# Altium schematic sheet STM32G0B1CBT6TR.SchDoc
size 594 x 420 mm; SheetNumber: 2; SheetTotal: 4
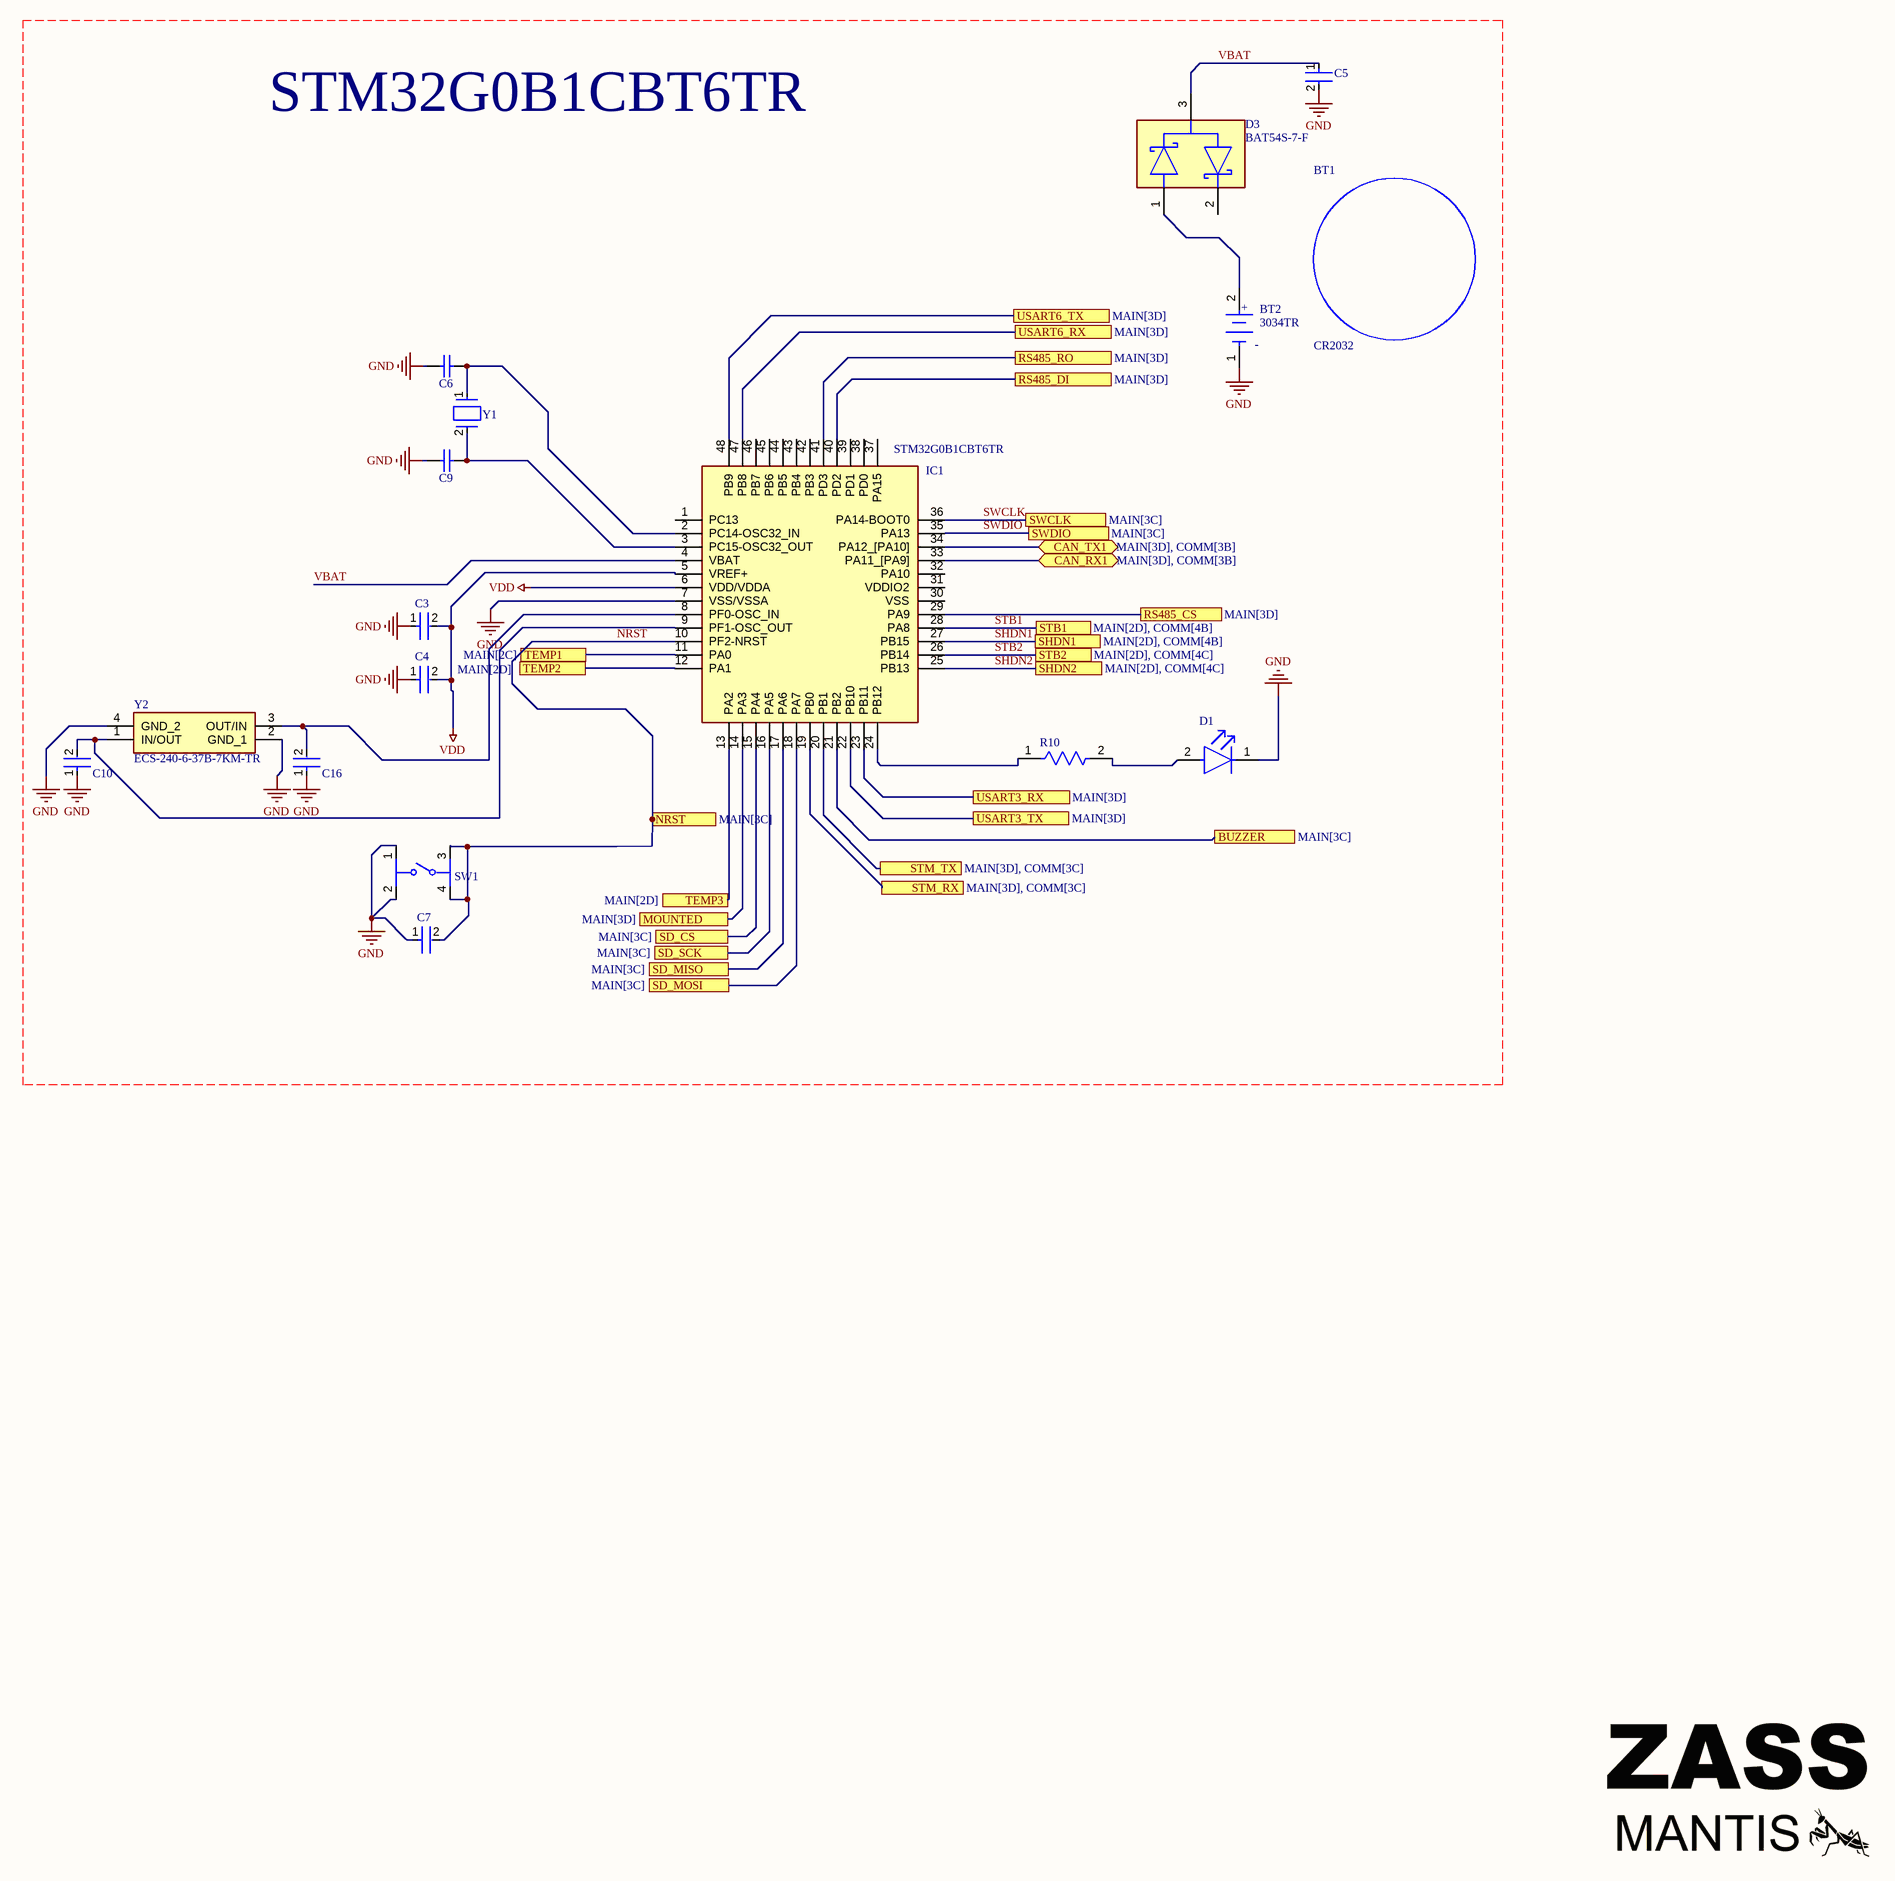
[diagram p0: STM32G0B1CBT6TR.SchDoc]

## Parts
BT1  CR2032  [FP-CR2032-MFG]
BT2  3034TR  [FP-3034TR-MFG]
C3  C0805C104K5RACTU  [FP-C0805C-DN-MFG]  (value not drawn)
C4  C0805C104K5RACTU  [FP-C0805C-DN-MFG]  (value not drawn)
C5  CC0805KRX7R5BB104  [FP-CC0805-EA-MFG]  (value not drawn)
C6  06035A220KAT2A  [CAPC1608X90X35ML15T15]  (value not drawn)
C7  C0805C104K5RACTU  [FP-C0805C-DN-MFG]  (value not drawn)
C9  06035A220KAT2A  [CAPC1608X90X35ML15T15]  (value not drawn)
C10  C0805C519D3HACTU  [FP-C0805C-DN-MFG]  (value not drawn)
C16  C0805C519D3HACTU  [FP-C0805C-DN-MFG]  (value not drawn)
D1  LTST-C230EKT  [FP-LTST-C230EKT-MFG]  (value not drawn)
D3  BAT54S-7-F  [FP-SOT23-MFG]
IC1  STM32G0B1CBT6TR  [QFP50P900X900X160-48N]
R10  CRGCQ1206F1K0  [FP-CRGCQ1206-IPC_C]  (value not drawn)
SW1  PTS647SK38SMTR2LFS  [FP-PTS647SK38SMTR2LFS-MFG]  (value not drawn)
Y1  ECX-.327-CDX-1293  [FP-ECS-CDX-MFG]  (value not drawn)
Y2  ECS-240-6-37B-7KM-TR  [ECS240637B7KMTR]

## Ports
BUZZER (see MAIN[3C]), CAN_RX1 (bidir, see MAIN[3D], COMM[3B]), CAN_TX1 (bidir, see MAIN[3D], COMM[3B]), MOUNTED (see MAIN[3D]), NRST (see MAIN[3C]), RS485_CS (see MAIN[3D]), RS485_DI (see MAIN[3D]), RS485_RO (see MAIN[3D]), SD_CS (see MAIN[3C]), SD_MISO (see MAIN[3C]), SD_MOSI (see MAIN[3C]), SD_SCK (see MAIN[3C]), SHDN1 (see MAIN[2D], COMM[4B]), SHDN2 (see MAIN[2D], COMM[4C]), STB1 (see MAIN[2D], COMM[4B]), STB2 (see MAIN[2D], COMM[4C]), STM_RX (see MAIN[3D], COMM[3C]), STM_TX (see MAIN[3D], COMM[3C]), SWCLK (see MAIN[3C]), SWDIO (see MAIN[3C]), TEMP1 (see MAIN[2C]), TEMP2 (see MAIN[2D]), TEMP3 (see MAIN[2D]), USART3_RX (see MAIN[3D]), USART3_TX (see MAIN[3D]), USART6_RX (see MAIN[3D]), USART6_TX (see MAIN[3D])

## Nets
GND: BT2.1(C) C3.1 C4.1 C5.2 C6.1 C7.1 C9.1 C10.1 C16.1 D1.1(C) IC1.7(VSS/VSSA) SW1.1 SW1.2 Y2.2(GND_1) Y2.4(GND_2)
VDD: C3.2 C4.2 IC1.5(VREF+) IC1.6(VDD/VDDA)
BUZZER: IC1.21(PB2) ; port BUZZER
CAN_RX1: IC1.33(PA11_[PA9]) ; port CAN_RX1
CAN_TX1: IC1.34(PA12_[PA10]) ; port CAN_TX1
MOUNTED: IC1.14(PA3) ; port MOUNTED
NRST: C7.2 IC1.10(PF2-NRST) SW1.3 SW1.4 ; port NRST
RS485_CS: IC1.29(PA9) ; port RS485_CS
RS485_DI: IC1.40(PD2) ; port RS485_DI
RS485_RO: IC1.41(PD3) ; port RS485_RO
SD_CS: IC1.15(PA4) ; port SD_CS
SD_MISO: IC1.17(PA6) ; port SD_MISO
SD_MOSI: IC1.18(PA7) ; port SD_MOSI
SD_SCK: IC1.16(PA5) ; port SD_SCK
SHDN1: IC1.27(PB15) ; port SHDN1
SHDN2: IC1.25(PB13) ; port SHDN2
STB1: IC1.28(PA8) ; port STB1
STB2: IC1.26(PB14) ; port STB2
STM_RX: IC1.19(PB0) ; port STM_RX
STM_TX: IC1.20(PB1) ; port STM_TX
SWCLK: IC1.36(PA14-BOOT0) ; port SWCLK
SWDIO: IC1.35(PA13) ; port SWDIO
TEMP1: IC1.11(PA0) ; port TEMP1
TEMP2: IC1.12(PA1) ; port TEMP2
TEMP3: IC1.13(PA2) ; port TEMP3
USART3_RX: IC1.23(PB11) ; port USART3_RX
USART3_TX: IC1.22(PB10) ; port USART3_TX
USART6_RX: IC1.47(PB8) ; port USART6_RX
USART6_TX: IC1.48(PB9) ; port USART6_TX
VBAT: C5.1 D3.3 IC1.4(VBAT)
NetBT2_2: BT2.2(A) D3.1
NetC6_2: C6.2 IC1.2(PC14-OSC32_IN) Y1.1(In/Out)
NetC9_2: C9.2 IC1.3(PC15-OSC32_OUT) Y1.2(Out/In)
NetC10_2: C10.2 IC1.9(PF1-OSC_OUT) Y2.1(IN/OUT)
NetC16_2: C16.2 IC1.8(PF0-OSC_IN) Y2.3(OUT/IN)
NetD1_2: D1.2(A) R10.2
NetIC1_24: IC1.24(PB12) R10.1

Not connected (* = marked no-connect by the designer): D3 2; IC1 1(PC13) 30(VSS) 31(VDDIO2) 32(PA10) 37(PA15) 38(PD0) 39(PD1) 42(PB3) 43(PB4) 44(PB5) 45(PB6) 46(PB7)

## Notes on the sheet
- STM32G0B1CBT6TR
- DWG NO:
- REV:
- THIS DOCUMENT AND THE DATA DISCLOSED HEREIN OR
- HEREWITH IS THE PROPERTY OF ALTIUM LIMITED AND MAY
- BE FREELY DISTRIBUTED IN WHOLE. NO RIGHTS ARE
- RESERVED OR EXPRESS OR IMPLIED WARANTEE GIVEN.
- REVISION
- DESCRIPTION
- DATE
- APPROVED
- PROJECT
- PROJECT REVISION:
- TITLE
- A2
- SIZE
- FILE NAME
- SHEET
- OF
- (in symbol CMP-19636-000007-1) +; -

## Library data of the parts
BT1 = CMP-05417-000003-1: BATTERY LITHIUM 3V COIN 20MM; Manufacturer: Panasonic; ComponentLink2URL: https://upverter.com/datasheet/5ee6469450a36cf26ddc1e0271adf06b3d83bec7.pdf; Device Class L3: unset; Device Class L1: Passive Components; Temperature Range Low: -30°C; Package: CR2032; Mouser Description: Battery; Lithium High Energy; 3 VoltS; 230 MAH; Coin Cell; ComponentLink2Description: Datasheet; Device Class L2: unset; Manufacturer Part Number: CR2032; Octopart: https://octopart.com/cr2032-panasonic-39385932; Temperature Range High: +60°C; Temperature: -30°C to +60°C; Automotive: No; Category: Batt; Height: 3.2mm
BT2 = CMP-19636-000007-1: BATTERY RETAINER COIN 20MM SMD; Number of Batteries: 1; Lead Free: Lead Free; Mount: Surface Mount; Number of Cells: 1; Termination: SMD/SMT; Package Quantity: 500; Packaging: Tape and Reel; Contact Plating: Tin; Case/Package: SMD/SMT; Material: Bronze
C3 C4 C7 = CMP-2007-00279-2: CAP CER 0.1UF 50V X7R 0805; Manufacturer: KEMET; Value: 0.10 μF; Tolerance: 0.1; Temperature Coefficient: 30ppm/°C; Material: Ceramic; Manufacturer Part Number: C0805C104K5RACTU; Device Class L2: Capacitors; Temperature Range Low: -55°C; Voltage Rating: 50 V; Digikey Description: CAP CER 0.1UF 50V X7R 0805; Category: Cap; ComponentLink2Description: Datasheet; Octopart: https://octopart.com/c0805c104k5ractu-kemet-143926; RoHS: TRUE; ComponentLink2URL: https://content.kemet.com/datasheets/KEM_C1003_C0G_SMD.pdf; Temperature Characteristic: X7R; Temperature: -55°C to +125°C; Height: 0.88mm; Temperature Range High: +125°C; Device Class L1: Passive Components; Automotive: No; Lead Free: Yes; Ipc Land Pattern Name: CAPC200125X78; Device Class L3: Ceramic Capacitors; Mouser Description: Cap Ceramic 0.1uF 50V X7R 10% SMD 2.0 x 1.2 mm 125 C Paper T/R; Capacitance: 0.10 μF; Package: C0805C-DN
C5 = CMP-03422-000810-2: CAP CER X7R 0805; RoHS Compliant: Yes
C6 C9 = CMP-2006-04272-1: Manufacturer: AVX Interconnect / Elco; Part Number: 06035A220KAT2A
C10 C16 = CMP-03020-033346-1: C0805 5.1 pF X8R 30ppm/°C 0.5 pF 25 V; Manufacturer: KEMET; Voltage Rating: 25 V; Tolerance: 0.5 pF; Capacitance: 5.1 pF; Value: 5.1 pF; Material: Ceramic; Category: Cap; Lead Free: Yes; Temperature Characteristic: X8R; Manufacturer Part Number: C0805C519D3HACTU; Ipc Land Pattern Name: CAPC200125X78; ComponentLink2Description: Datasheet; Package: C0805C-DN; Device Class L2: Capacitors; Automotive: No; Octopart: https://octopart.com/c0805c519d3hactu-kemet-88727353; Device Class L1: Passive Components; Temperature Coefficient: 30ppm/°C; Temperature Range High: +125°C; Height: 0.88mm; Temperature Range Low: -55°C; ComponentLink2URL: https://content.kemet.com/datasheets/KEM_C1003_C0G_SMD.pdf; Device Class L3: Ceramic Capacitors; RoHS: TRUE; Temperature: -55°C to +125°C
D1 = CMP-22017-000030-1: LED RED CLEAR CHIP SMD; Forward Current: 30mA; Test Current: 10mA; Number of Elements: 1; Viewing Angle: 130°; Dominant Wavelength: 621nm; Forward Voltage: 2V; Lens Style: Diffused; Power Rating: 100mW; Reverse Voltage: 5V; Wavelength: 630nm; Luminous Intensity: 6mcd; Lens Color: Colorless; Case/Package: 1206; Case Code (Imperial): 1206; Package Quantity: 1; Lead Free: Lead Free; Case Code (Metric): 3216; Height: 1.1mm; Lens Transparency: Clear; Mount: Surface Mount; Depth: 1.6mm; Number of LEDs: 1; Power Dissipation: 100mW; Max Operating Temperature: 85°C; Width: 1.6mm; Color: Red; Number of Pins: 2; Min Operating Temperature: -55°C; Packaging: Tape and Reel; Radiation Hardening: No; Illumination Color: Red; Length: 3.2mm
D3 = CMP-1667-00006-2: DIODE ARRAY SCHOTTKY 30V SOT23-3; Forward Voltage: 800mV; Reverse Recovery Time: 5ns; Peak Non-Repetitive Surge Current: 600mA; Power Rating: 200mW; Current Rating: 200mA; Peak Reverse Current: 2uA; Capacitance: 10pF; Width: 1.3mm; Mount: Surface Mount; Height: 1mm; Number of Pins: 3; Weight: 0.000282oz; Max Reverse Voltage (DC): 30V; Max Power Dissipation: 200mW; Lead Free: Lead Free; Max Operating Temperature: 150°C; Min Operating Temperature: -65°C; Package Quantity: 3000; REACH SVHC: No SVHC; Termination: SMD/SMT; Max Forward Surge Current (Ifsm): 600mA; Radiation Hardening: No; Voltage Rating (DC): 30V; Average Rectified Current: 200mA; Max Repetitive Reverse Voltage (Vrrm): 30V; Contact Plating: Tin; Case/Package: SOT-23; Forward Current: 200mA; Power Dissipation: 200mW; Length: 2.9mm; Packaging: Tape and Reel
IC1 = STM32G0B1CBT6TR: Integrated Circuit; Manufacturer_Name: STMicroelectronics; Datasheet Link: https://www.st.com/resource/en/datasheet/stm32g0b1cc.pdf; Height: 1.6mm; Manufacturer_Part_Number: STM32G0B1CBT6TR; Mouser Part Number: 511-STM32G0B1CBT6TR; Mouser Price/Stock: https://www.mouser.co.uk/ProductDetail/STMicroelectronics/STM32G0B1CBT6TR?qs=HoCaDK9Nz5cqFCA6TLpp%252Bw%3D%3D; Arrow Part Number: STM32G0B1CBT6TR; Arrow Price/Stock: https://www.arrow.com/en/products/stm32g0b1cbt6tr/stmicroelectronics?utm_currency=USD&region=nac
R10 = CMP-03211-006592-1: CRGCQ1206 1KΩ 0.25W 1% ±100ppm/°C 200V; Manufacturer: TE Connectivity; Automotive Grade: Grade 685; Tolerance: 0.01; Ipc Land Pattern Name: RESC310155X55; Temperature Range Low: -55°C; Device Class L3: Chip SMD Resistors; ComponentLink2URL: https://www.te.com/commerce/DocumentDelivery/DDEController?Action=showdoc&DocId=Data+Sheet%7F1773204-3%7F1%7Fpdf%7FEnglish%7FENG_DS_1773204-3_1.pdf%7F4-2176347-694; Automotive: Yes; Temperature: -55°C to +155°C; Manufacturer Part Number: CRGCQ1206F1K0; Package: CRGCQ1206; Octopart: https://octopart.com/crgcq1206f1k0-te+connectivity-91018258; Device Class L1: Passive Components; Series: CRGCQ; Device Class L2: Resistors; RoHS: TRUE; Lead Free: Yes; ComponentLink2Description: Datasheet; Power Rating: 0.25W; Temperature Coefficient: ±100ppm/°C; Value: 1KΩ; Voltage Rating: 200V; Temperature Range High: +155°C; Height: 0.65mm; Category: Res; Resistance: 1KΩ; Composition: Thick Film; Ambient Temperature Range High: +70°C
SW1 = CMP-10040-000033-1: TACT 4.5 X 4.5, 3.8 MM H, 2.5N,; Switch Function: Off-Mom; Switch Travel: 0.25mm; Actuator Type: Standard; Illumination Type: Non-Illuminated; Mechanical Life: 100000Cycles; Ratings: IP40; Operating Force: 250gf; Throw Configuration: SPST; Max Operating Temperature: 70°C; Min Operating Temperature: -20°C; Termination: Gull Wing; Mount: Surface Mount; Packaging: Tape and Reel
Y1 = CMP-40224-000016-1: CRYSTAL 32.7680KHZ 12.5PF SMD; ESR (Equivalent Series Resistance): 70kR; Frequency: 32.768kHz; Frequency Tolerance: 5ppm; Load Capacitance: 12.5pF; Packaging: Tape and Reel; Case/Package: SMD/SMT; Min Operating Temperature: -40°C; Max Operating Temperature: 85°C; Mount: Surface Mount
Y2 = ECS-240-6-37B-7KM-TR: Crystal or Oscillator; Manufacturer_Name: ECS; Datasheet Link: https://ecsxtal.com/store/pdf/ECX-1637B.pdf; Height: 0.5mm; Manufacturer_Part_Number: ECS-240-6-37B-7KM-TR; Mouser Part Number: 520-240-6-37B-7KM-TR; Mouser Price/Stock: https://www.mouser.co.uk/ProductDetail/ECS/ECS-240-6-37B-7KM-TR?qs=B6kkDfuK7%2FDaYBrL7UqWUQ%3D%3D; Arrow Part Number: ECS-240-6-37B-7KM-TR; Arrow Price/Stock: https://www.arrow.com/en/products/ecs-240-6-37b-7km-tr/ecs-international?region=europe